# EAGLE schematic ADE7758 (EAGLE 7.1.0)
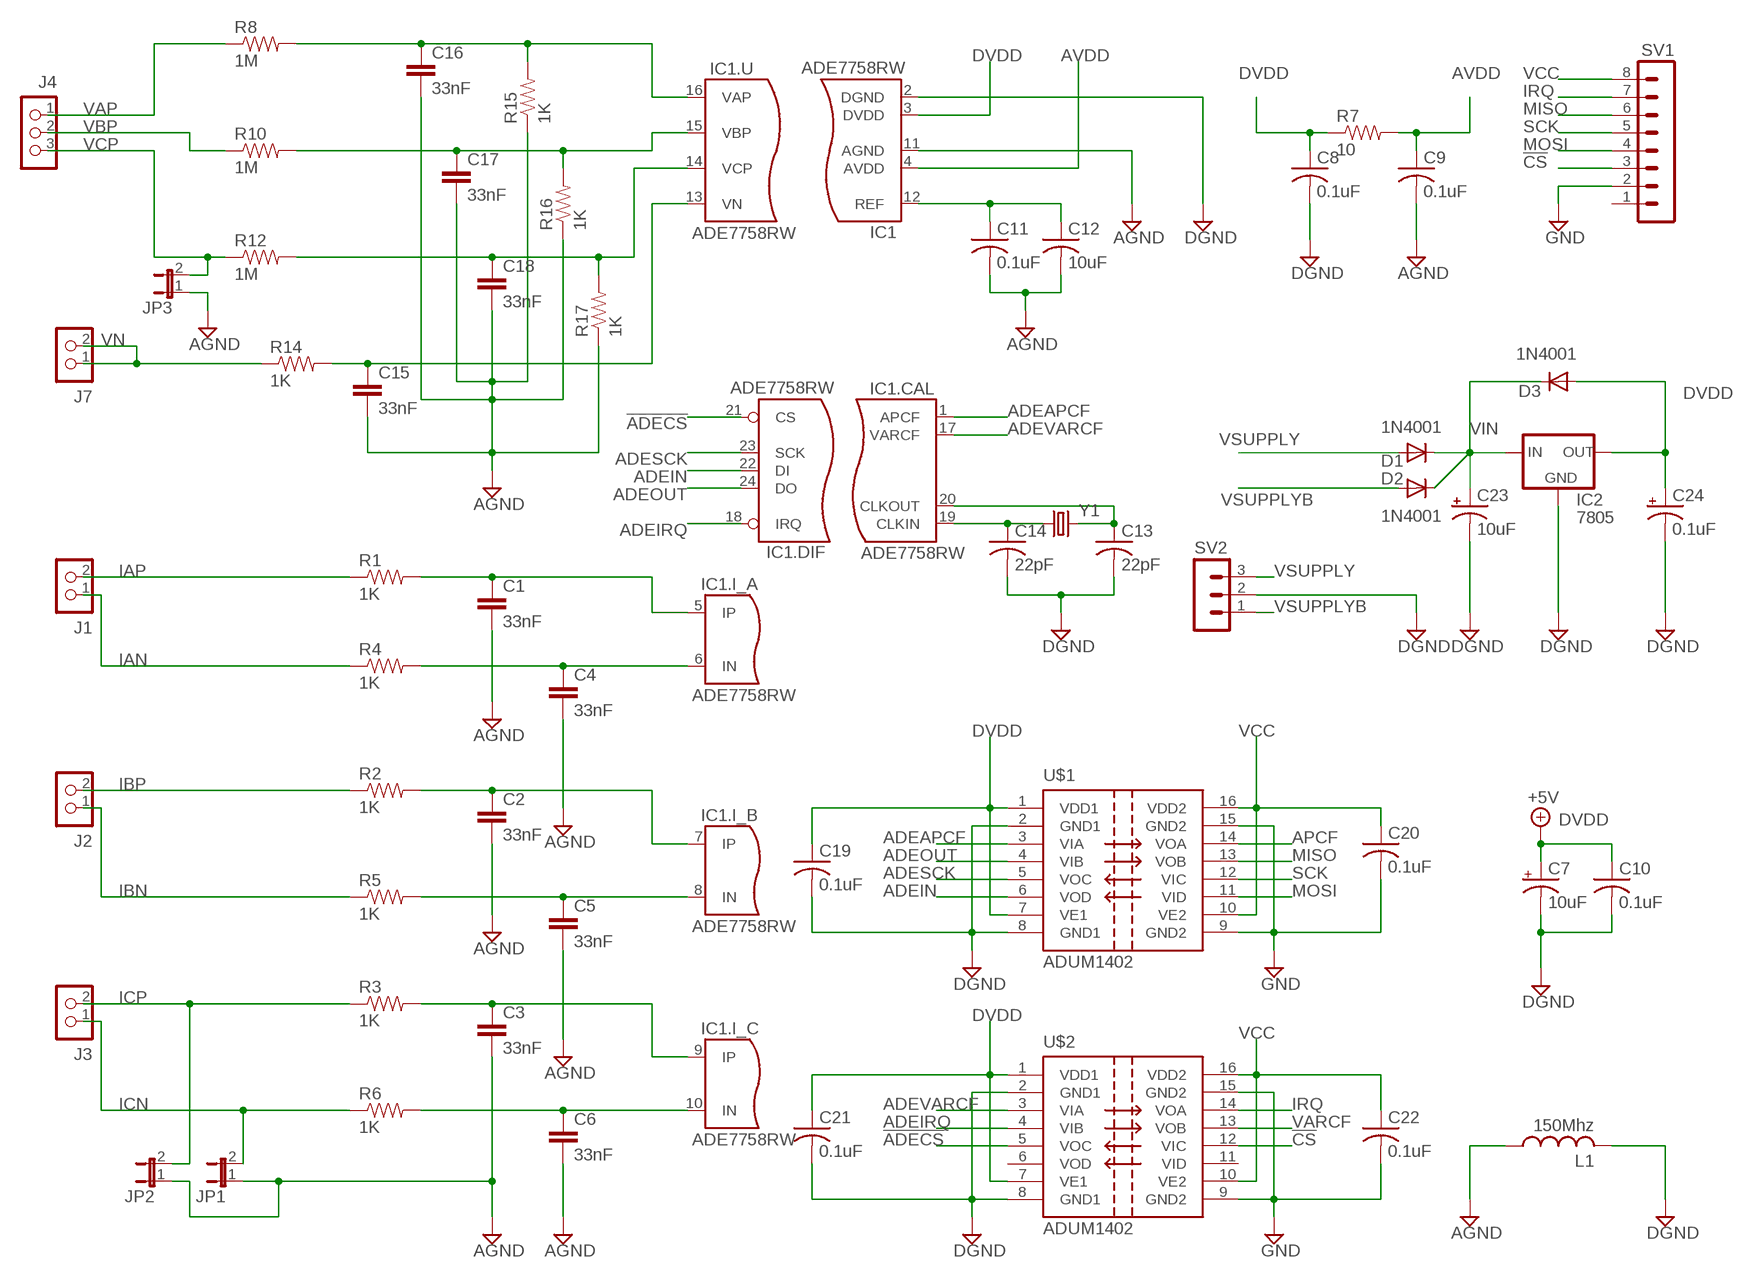
[diagram p0: schematic, sheet 1]

## Parts
C1  33nF  CAPPTH2  [CAP-PTH-SMALL2]
C2  33nF  CAPPTH2  [CAP-PTH-SMALL2]
C3  33nF  CAPPTH2  [CAP-PTH-SMALL2]
C4  33nF  CAPPTH2  [CAP-PTH-SMALL2]
C5  33nF  CAPPTH2  [CAP-PTH-SMALL2]
C6  33nF  CAPPTH2  [CAP-PTH-SMALL2]
C7  10uF  CPOL-USC/6032-28R  [C/6032-28R]
C8  0.1uF  C-USC0805  [C0805]
C9  0.1uF  C-USC0805  [C0805]
C10  0.1uF  C-USC0805  [C0805]
C11  0.1uF  C-USC0805K  [C0805K]
C12  10uF  C-USC0805K  [C0805K]
C13  22pF  C-USC0805K  [C0805K]
C14  22pF  C-USC0805K  [C0805K]
C15  33nF  CAPPTH2  [CAP-PTH-SMALL2]
C16  33nF  CAPPTH2  [CAP-PTH-SMALL2]
C17  33nF  CAPPTH2  [CAP-PTH-SMALL2]
C18  33nF  CAPPTH2  [CAP-PTH-SMALL2]
C19  0.1uF  C-USC0805  [C0805]
C20  0.1uF  C-USC0805  [C0805]
C21  0.1uF  C-USC0805  [C0805]
C22  0.1uF  C-USC0805  [C0805]
C23  10uF  CAP_POLPTH1  [CPOL-RADIAL-100UF-25V]
C24  0.1uF  CAP_POLPTH2  [CPOL-RADIAL-10UF-25V]
D1  1N4001  DIODE-D-7.5  [D-7.5]
D2  1N4001  DIODE-D-7.5  [D-7.5]
D3  1N4001  DIODE-D-7.5  [D-7.5]
IC1  ADE7758RW  [SOIC24]
IC2  7805  78XXS  [78XXS]
J1  CON_TERMINAL_BLOCK_02-5MM  [TERMINAL_BLOCK_2P_5]
J2  CON_TERMINAL_BLOCK_02-5MM  [TERMINAL_BLOCK_2P_5]
J3  CON_TERMINAL_BLOCK_02-5MM  [TERMINAL_BLOCK_2P_5]
J4  CON_TERMINAL_BLOCK_03-5MM  [TERMINAL_BLOCK_3P_5]
J7  CON_TERMINAL_BLOCK_02-5MM  [TERMINAL_BLOCK_2P_5]
JP1  JP1E  [JP1]
JP2  JP1E  [JP1]
JP3  JP1E  [JP1]
L1  150Mhz  L-US0207/5V  [0207/5V]
R1  1K  RESISTORPTH-1/4W  [AXIAL-0.4]
R2  1K  RESISTORPTH-1/4W  [AXIAL-0.4]
R3  1K  RESISTORPTH-1/4W  [AXIAL-0.4]
R4  1K  RESISTORPTH-1/4W  [AXIAL-0.4]
R5  1K  RESISTORPTH-1/4W  [AXIAL-0.4]
R6  1K  RESISTORPTH-1/4W  [AXIAL-0.4]
R7  10  RESISTORPTH-1/4W  [AXIAL-0.4]
R8  1M  RESISTORPTH-1/4W  [AXIAL-0.4]
R10  1M  RESISTORPTH-1/4W  [AXIAL-0.4]
R12  1M  RESISTORPTH-1/4W  [AXIAL-0.4]
R14  1K  RESISTORPTH-1/4W  [AXIAL-0.4]
R15  1K  RESISTORPTH-1/4W  [AXIAL-0.4]
R16  1K  RESISTORPTH-1/4W  [AXIAL-0.4]
R17  1K  RESISTORPTH-1/4W  [AXIAL-0.4]
SV1  MA08-1  [MA08-1]
SV2  MA03-1  [MA03-1]
U$1  ADUM1402  [SO16W]
U$2  ADUM1402  [SO16W]
Y1  CRYSTALHC49US  [HC49US]

## Nets
!ADECS: IC1.21(CS) U$2.5(VOC)
!CS: SV1.3 U$2.12(VIC)
ADEAPCF: IC1.1(APCF) U$1.3(VIA)
ADEIN: IC1.22(DI) U$1.6(VOD)
ADEIRQ: IC1.18(IRQ) U$2.4(VIB)
ADEOUT: IC1.24(DO) U$1.4(VIB)
ADESCK: IC1.23(SCK) U$1.5(VOC)
ADEVARCF: IC1.17(VARCF) U$2.3(VIA)
AGND: C1.2 C2.2 C3.2 C4.2 C5.2 C6.2 C9.2 C11.2 C12.2 C15.2 C16.2 C17.2 C18.2 IC1.11(AGND) JP1.1 JP2.1 JP3.1 L1.1 R15.P$1 R16.P$1 R17.P$1
APCF: U$1.14(VOA)
AVDD: C9.1 IC1.4(AVDD) R7.P$2
DGND: C7.- C8.2 C10.2 C13.2 C14.2 C19.2 C21.2 C23.2(-) C24.2(-) IC1.2(DGND) IC2.GND L1.2 SV2.2 U$1.2(GND1) U$1.8(GND1) U$2.2(GND1) U$2.8(GND1)
DVDD: C7.+ C8.1 C10.1 C19.1 C21.1 C24.1(+) D3.A IC1.3(DVDD) IC2.OUT R7.P$1 U$1.1(VDD1) U$1.7(VE1) U$2.1(VDD1) U$2.7(VE1) ; supply symbol labelled +5V
GND: C20.2 C22.2 SV1.2 U$1.9(GND2) U$1.15(GND2) U$2.9(GND2) U$2.15(GND2)
IAN: J1.1 R4.P$1
IAP: J1.2 R1.P$1
IBN: J2.1 R5.P$1
IBP: J2.2 R2.P$1
ICN: J3.1 JP1.2 R6.P$1
ICP: J3.2 JP2.2 R3.P$1
IRQ: SV1.7 U$2.14(VOA)
MISO: SV1.6 U$1.13(VOB)
MOSI: SV1.4 U$1.11(VID)
N$1: C1.1 IC1.5(IP) R1.P$2
N$2: C6.1 IC1.10(IN) R6.P$2
N$3: C3.1 IC1.9(IP) R3.P$2
N$4: C4.1 IC1.6(IN) R4.P$2
N$5: C5.1 IC1.8(IN) R5.P$2
N$6: C11.1 C12.1 IC1.12(REF)
N$7: C2.1 IC1.7(IP) R2.P$2
N$10: C14.1 IC1.19(CLKIN) Y1.1
N$11: C13.1 IC1.20(CLKOUT) Y1.2
N$13: C15.1 IC1.13(VN) R14.P$2
N$15: C16.1 IC1.16(VAP) R8.P$2 R15.P$2
N$16: C17.1 IC1.15(VBP) R10.P$2 R16.P$2
N$17: C18.1 IC1.14(VCP) R12.P$2 R17.P$2
SCK: SV1.5 U$1.12(VIC)
VAP: J4.1 R8.P$1
VARCF: U$2.13(VOB)
VBP: J4.2 R10.P$1
VCC: C20.1 C22.1 SV1.8 U$1.10(VE2) U$1.16(VDD2) U$2.10(VE2) U$2.16(VDD2)
VCP: J4.3 JP3.2 R12.P$1
VIN: C23.1(+) D1.C D2.C D3.C IC2.IN
VN: J7.1 J7.2 R14.P$1
VSUPPLY: D1.A SV2.3
VSUPPLYB: D2.A SV2.1
Unconnected: SV1.1 U$2.6(VOD) U$2.11(VID)

## Library data of the parts
C1-C6 C15-C18 = SparkFun-Passives:CAP: Capacitor Standard 0603 ceramic capacitor, and 0.1" leaded capacitor.
C7 = rcl:CPOL-US: POLARIZED CAPACITOR, American symbol
C8-C14 C19-C22 = rcl:C-US: CAPACITOR, American symbol
C23 C24 = SparkFun-Capacitors:CAP_POL: Capacitor Polarized These are standard SMD and PTH capacitors. Normally 10uF, 47uF, and 100uF in electrolytic and tantalum varieties. Always verify the external diameter of the through hole cap, it varies with capacity, voltage, and manufacturer. The EIA devices should be standard.; MPN: 06034D106MAT2A; OC_NEWARK: 10R5934
D1-D3 = diode:DIODE-: DIODE; OC_NEWARK: unknown
IC1 = ade7758:ADE7758: Poly Phase Multifunction Energy Metering IC with Per Phase Information FEATURES Highly accurate; supports IEC 60687, IEC 61036, IEC 61268, IEC 62053-21, IEC 62053-22, and IEC 62053-23 Compatible with 3-phase/3-wire, 3-phase/4-wire, and other 3-phase services Less than 0.1% active energy error over a dynamic range of 1000 to 1 at 25°C Supplies active/reactive/apparent energy, voltage rms, current rms, and sampled waveform data Two pulse outputs, one for active power and the other selectable between reactive and apparent power with programmable frequency Digital power, phase, and rms offset calibration On-chip, user-programmable thresholds for line voltage SAG and overvoltage detections An on-chip, digital integrator enables direct interface-to-current sensors with di/dt output A PGA in the current channel allows direct interface to shunts and current transformers An SPI®-compatible serial interface with IRQ Proprietary ADCs and DSP provide high accuracy over large variations in environmental conditions and time Reference 2.4 V (drift 30 ppm/°C typical) with external overdrive capability Single 5 V supply, low power (70 mW typical)
IC2 = v-reg:78XXS: VOLTAGE REGULATOR
J1-J3 J7 = dp_devices:CON_TERMINAL_BLOCK_02: 2 poles wire to board terminal block
J4 = dp_devices:CON_TERMINAL_BLOCK_03: 3 poles, wire to board connector
JP1-JP3 = jumper:JP1E: JUMPER
L1 = rcl:L-US: INDUCTOR, American symbol
R1-R8 R10 R12 R14-R17 = SparkFun-Passives:RESISTOR: Resistor Basic schematic elements and footprints for 0603, 1206, and PTH resistors.
SV1 = con-lstb:MA08-1: PIN HEADER; OC_FARNELL: unknown; OC_NEWARK: unknown
SV2 = con-lstb:MA03-1: PIN HEADER; OC_FARNELL: unknown; OC_NEWARK: unknown
U$1 U$2 = adum140x:ADUM1402
Y1 = SparkFun-FreqCtrl:CRYSTAL: Various standard crystals. Proven footprints. Spark Fun Electronics SKU : COM-00534